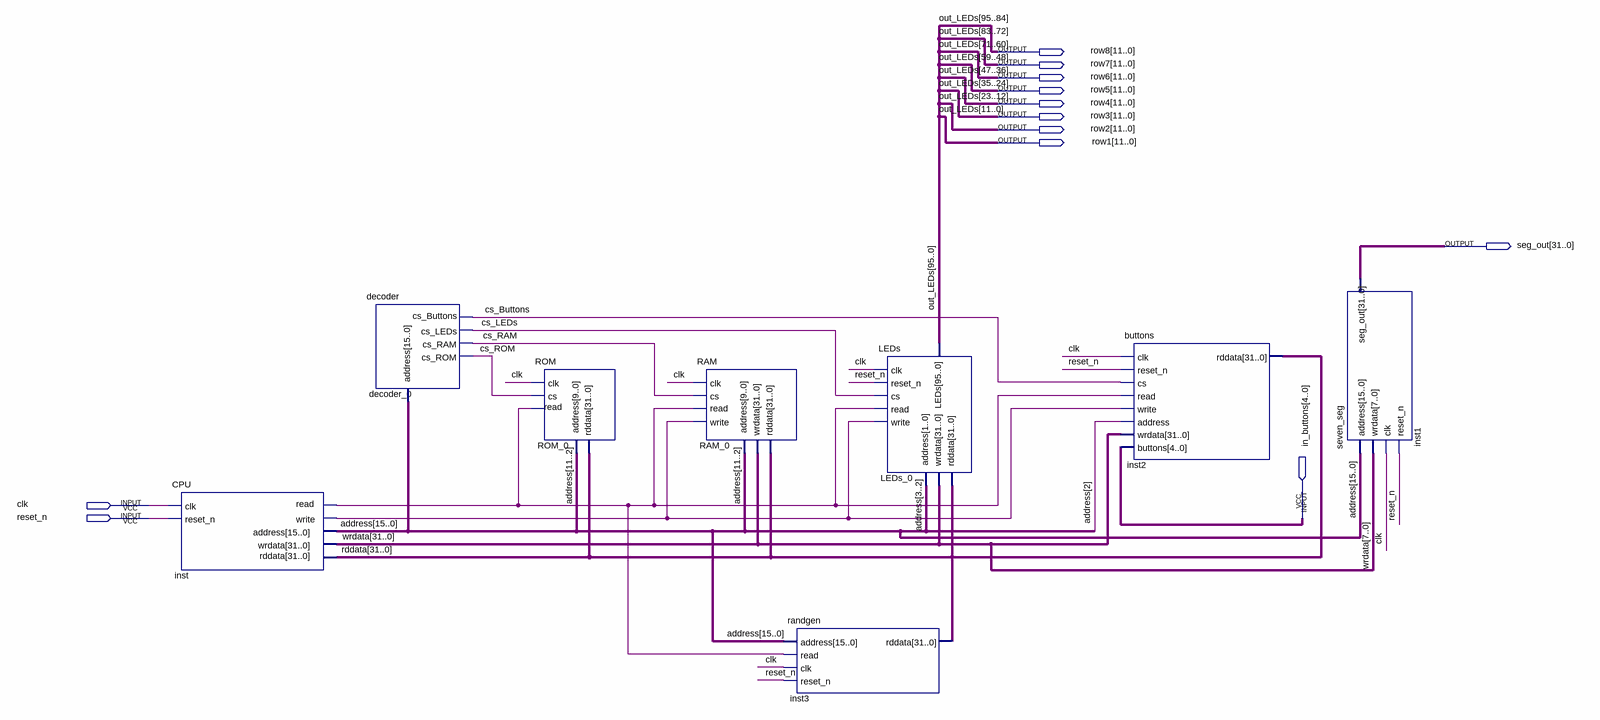
[diagram p0: schematic sheet]
// Quartus schematic GECKO.bdf as structural Verilog: 8 symbols, 12 pins
module GECKO (
  input  clk,
  input  reset_n,
  input  [4:0] in_buttons,
  output [11:0] row8,
  output [11:0] row7,
  output [11:0] row6,
  output [11:0] row5,
  output [11:0] row4,
  output [11:0] row3,
  output [11:0] row2,
  output [11:0] row1,
  output [31:0] seg_out
);

  wire cs_Buttons, cs_LEDs, cs_RAM, cs_ROM, inst_read, inst_write;
  wire [15:0] address;
  wire [31:0] rddata, wrdata;

  CPU inst (
    .clk(clk), .reset_n(reset_n), .rddata(rddata), .write(inst_write), .wrdata(wrdata), .address(address),
    .read(inst_read));
  decoder decoder_0 (.address(address), .cs_RAM(cs_RAM), .cs_ROM(cs_ROM), .cs_Buttons(cs_Buttons), .cs_LEDs(cs_LEDs));
  ROM ROM_0 (.clk(clk), .cs(cs_ROM), .read(inst_read), .address(address[11:2]), .rddata(rddata));
  RAM RAM_0 (
    .clk(clk), .cs(cs_RAM), .write(inst_write), .wrdata(wrdata), .read(inst_read), .address(address[11:2]),
    .rddata(rddata));
  randgen inst3 (.address(address), .read(inst_read), .clk(clk), .reset_n(reset_n), .rddata(rddata));
  LEDs LEDs_0 (
    .clk(clk), .reset_n(reset_n), .cs(cs_LEDs), .write(inst_write), .address(address[3:2]), .wrdata(wrdata),
    .read(inst_read), .rddata(rddata), .LEDs({row8, row7, row6, row5, row4, row3, row2, row1}));
  buttons inst2 (
    .clk(clk), .reset_n(reset_n), .cs(cs_Buttons), .read(inst_read), .write(inst_write),
    .address(address[2]), .wrdata(wrdata), .buttons(in_buttons), .rddata(rddata));
  seven_seg inst1 (.address(address), .wrdata(wrdata[7:0]), .clk(clk), .reset_n(reset_n), .seg_out(seg_out));

  // Other names for the same wires on the sheet: out_LEDs[95:0] = {row8, row7, row6, row5, row4, row3, row2, row1}
endmodule
